# EAGLE schematic hackdice_lite (EAGLE 5.12)
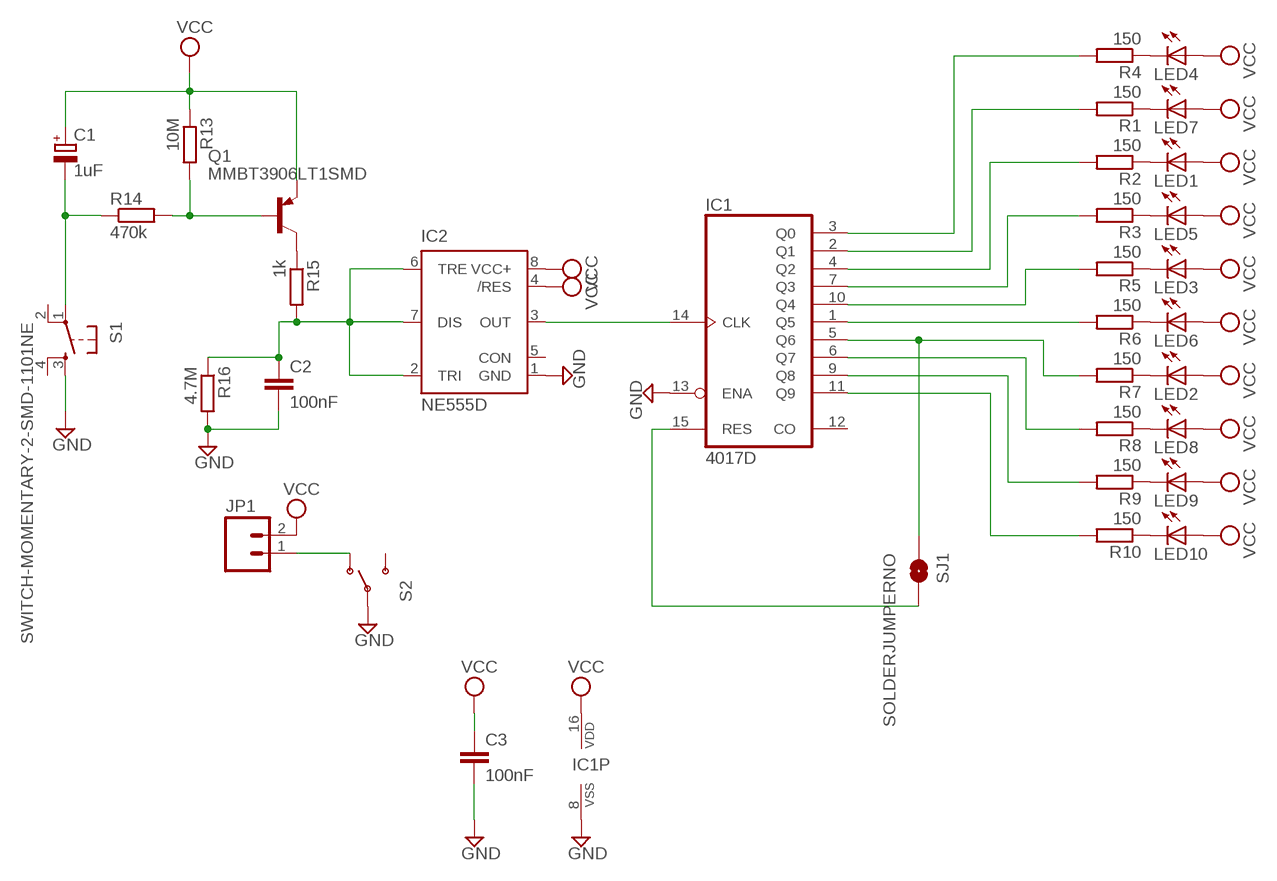
[diagram p0: schematic, sheet 1]

## Parts
C1  1uF  CPOL-EUB/3528-21R  [B/3528-21R]
C2  100nF  C-EUC0805K  [C0805K]
C3  100nF  C-EUC0805K  [C0805K]
IC1  4017D  [SO16]
IC2  NE555D  [SO08]
JP1  M02PTH3  [1X02_LONGPADS]
LED1  LED1206  [LED-1206]
LED2  LED1206  [LED-1206]
LED3  LED1206  [LED-1206]
LED4  LED1206  [LED-1206]
LED5  LED1206  [LED-1206]
LED6  LED1206  [LED-1206]
LED7  LED1206  [LED-1206]
LED8  LED1206  [LED-1206]
LED9  LED1206  [LED-1206]
LED10  LED1206  [LED-1206]
Q1  MMBT3906LT1SMD  [SOT23-BEC]
R1  150  R-EU_R1206  [R1206]
R2  150  R-EU_R1206  [R1206]
R3  150  R-EU_R1206  [R1206]
R4  150  R-EU_R1206  [R1206]
R5  150  R-EU_R1206  [R1206]
R6  150  R-EU_R1206  [R1206]
R7  150  R-EU_R1206  [R1206]
R8  150  R-EU_R1206  [R1206]
R9  150  R-EU_R1206  [R1206]
R10  150  R-EU_R1206  [R1206]
R13  10M  R-EU_R1206  [R1206]
R14  470k  R-EU_R1206  [R1206]
R15  1k  R-EU_R1206  [R1206]
R16  4.7M  R-EU_R1206  [R1206]
S1  SWITCH-MOMENTARY-2-SMD-1101NE  TAC_SWITCHSMD  [TACTILE_SWITCH_SMD]
S2  SWITCH-SPSTPTH  [SWITCH-SPDT]
SJ1  SOLDERJUMPERNO  [SJ_2S-NO]

## Nets
GND: C2.2 C3.2 IC1.8(VSS) IC1.13(ENA) IC2.1(GND) R16.2 S1.3 S2.2(P)
N$1: LED7.C R1.1
N$2: IC1.5(Q6) R7.2 SJ1.1
N$3: LED1.C R2.1
N$4: LED5.C R3.1
N$5: IC1.15(RES) SJ1.2
N$6: IC1.3(Q0) R4.2
N$7: IC1.2(Q1) R1.2
N$8: IC1.4(Q2) R2.2
N$9: IC1.7(Q3) R3.2
N$10: IC1.10(Q4) R5.2
N$11: LED4.C R4.1
N$12: LED3.C R5.1
N$13: LED6.C R6.1
N$14: LED2.C R7.1
N$15: IC1.6(Q7) R8.2
N$16: IC1.9(Q8) R9.2
N$17: IC1.11(Q9) R10.2
N$18: LED8.C R8.1
N$19: IC1.14(CLK) IC2.3(OUT)
N$20: Q1.B R13.2 R14.2
N$21: LED9.C R9.1
N$22: LED10.C R10.1
N$23: Q1.C R15.1
N$24: C2.1 IC2.2(TRI) IC2.6(TRE) IC2.7(DIS) R15.2 R16.1
N$25: IC1.1(Q5) R6.2
N$26: JP1.1 S2.1(O)
N$30: C1.- R14.1 S1.1
VCC: C1.+ C3.1 IC1.16(VDD) IC2.4(/RES) IC2.8(VCC+) JP1.2 LED1.A LED2.A LED3.A LED4.A LED5.A LED6.A LED7.A LED8.A LED9.A LED10.A Q1.E R13.1
Unconnected: IC1.12(CO) IC2.5(CON) S1.2 S1.4 S2.3(S)

## Library data of the parts
C1 = rcl:CPOL-EU: POLARIZED CAPACITOR, European symbol
C2 C3 = rcl:C-EU: CAPACITOR, European symbol
IC1 = 40xx:4017: COUNTER/DIVIDER
IC2 = SparkFun:NE555: General purpose bipolar Timer
JP1 = SparkFun:M02: Header 2 Standard 2-pin 0.1" header. Use with straight break away headers (SKU : PRT-00116), right angle break away headers (PRT-00553), swiss pins (PRT-00743), machine pins (PRT-00117), and female headers (PRT-00115). Molex polarized connector foot print use with SKU : PRT-08233 with associated crimp pins and housings.
LED1-LED10 = SparkFun:LED: LEDs Standard schematic elements and footprints for 5mm, 3mm, 1206, and 0603 sized LEDs. 5mm - Spark Fun Electronics SKU : COM-00529 (and others)
Q1 = transistor-pnp:MMBT3906*: PNP Transistror
R1-R10 R13-R16 = rcl:R-EU_: RESISTOR, European symbol
S1 = SparkFun:TAC_SWITCH: Momentary Switch Button commonly used for reset or general input. Spark Fun Electronics SKU : COM-00097
S2 = SparkFun:SWITCH-SPST: SPST Switch Simple slide switch. Spark Fun Electronics SKU : COM-00102
SJ1 = SparkFun:SOLDERJUMPER: Solder Jumper Standard SMD solder jumper. Used to automate production. Two varients : Normally Open and Normally Closed are the same, but have different paste layers. NC will have a large amount of paste and should jumper during reflow.